# Altium schematic sheet Jednoruki_bandit.SchDoc
size A4
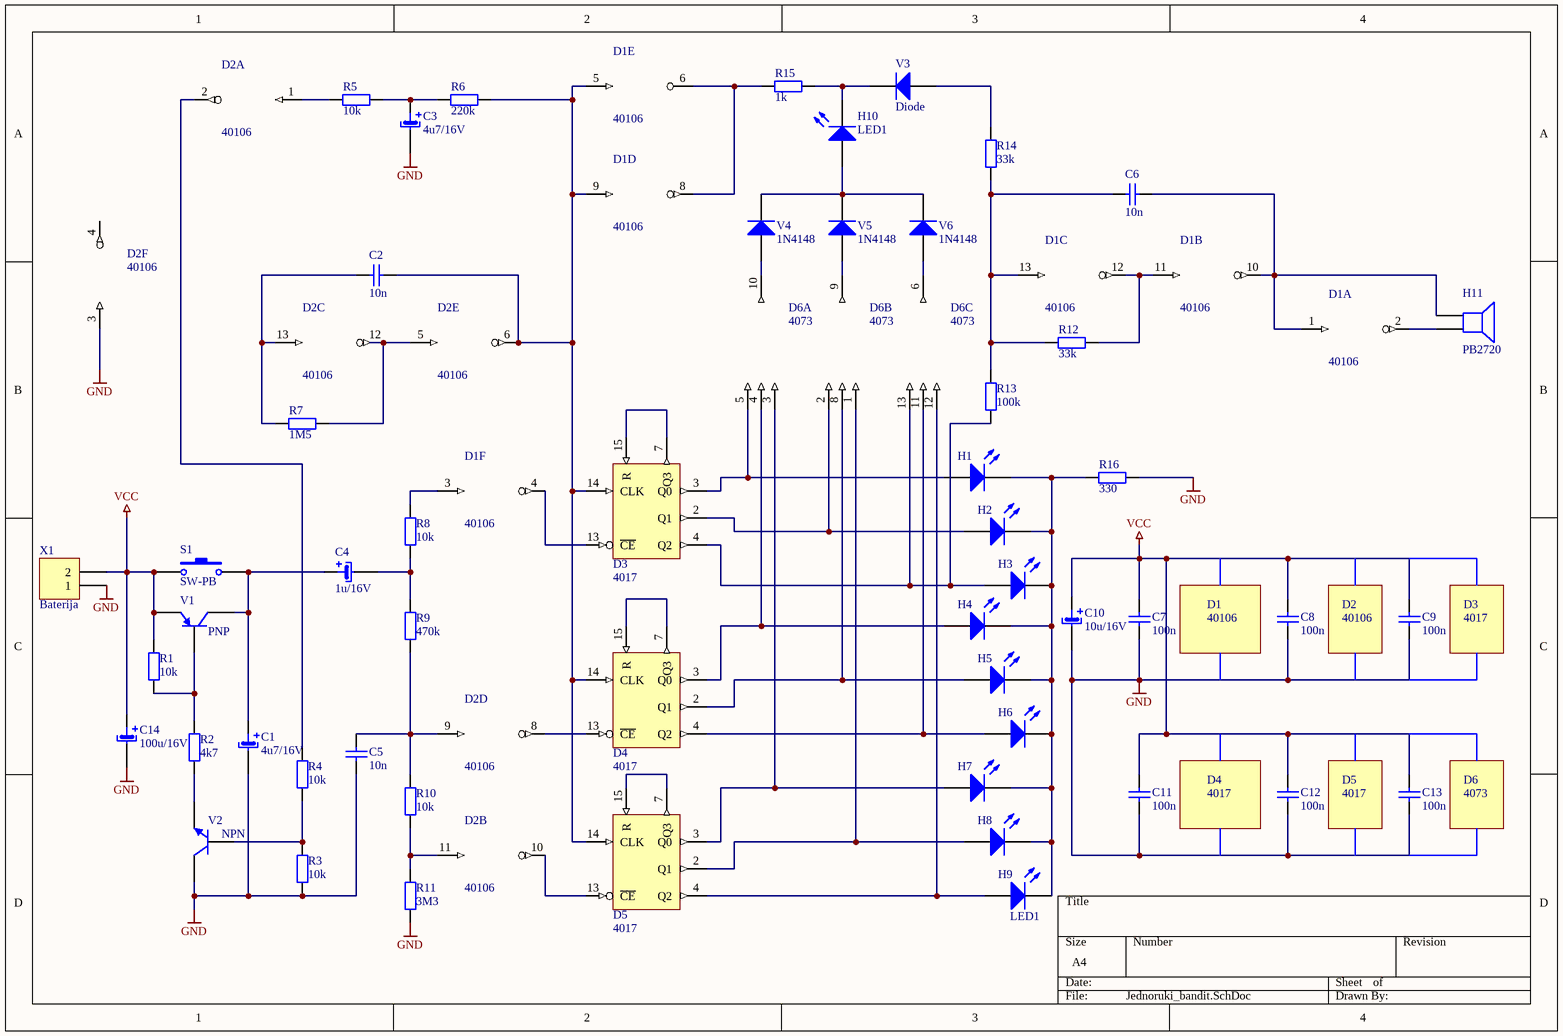
[diagram p0: Jednoruki_bandit.SchDoc]

## Parts
C1  4u7/16V  [CAPPR2-5x6.8]
C2  10n  [RAD-0.1]
C3  4u7/16V  [CAPPR2-5x6.8]
C4  1u/16V  [CAPPR2-5x6.8]
C5  10n  [RAD-0.1]
C6  10n  [RAD-0.1]
C7  100n  [RAD-0.1]
C8  100n  [RAD-0.1]
C9  100n  [RAD-0.1]
C10  10u/16V  [CAPPR2-5x6.8]
C11  100n  [RAD-0.1]
C12  100n  [RAD-0.1]
C13  100n  [RAD-0.1]
C14  100u/16V  [CAPPR2-5x6.8]
D1  40106  [DIP-14]  (parts A,B,C,D,E,F of 6)
D2  40106  [DIP-14]  (parts A,B,C,D,E,F of 6)
D3  4017  [DIP-16]
D4  4017  [DIP-16]
D5  4017  [DIP-16]
D6  4073  [DIP-14]  (parts A,B,C of 3)
H1  LED1  [LED-1]  (value not drawn)
H2  LED1  [LED-1]  (value not drawn)
H3  LED1  [LED-1]  (value not drawn)
H4  LED1  [LED-1]  (value not drawn)
H5  LED1  [LED-1]  (value not drawn)
H6  LED1  [LED-1]  (value not drawn)
H7  LED1  [LED-1]  (value not drawn)
H8  LED1  [LED-1]  (value not drawn)
H9  LED1  [LED-1]
H10  LED1  [LED-1]
H11  PB2720  [PIN2]
R1  10k  [AXIAL-0.4]
R2  4k7  [AXIAL-0.4]
R3  10k  [AXIAL-0.4]
R4  10k  [AXIAL-0.4]
R5  10k  [AXIAL-0.4]
R6  220k  [AXIAL-0.4]
R7  1M5  [AXIAL-0.4]
R8  10k  [AXIAL-0.4]
R9  470k  [AXIAL-0.4]
R10  10k  [AXIAL-0.4]
R11  3M3  [AXIAL-0.4]
R12  33k  [AXIAL-0.4]
R13  100k  [AXIAL-0.4]
R14  33k  [AXIAL-0.4]
R15  1k  [AXIAL-0.4]
R16  330  [AXIAL-0.4]
S1  SW-PB  [SPST-2]
V1  PNP  [TO-92A]
V2  NPN  [TO-92A]
V3  Diode  [DO-35]
V4  1N4148  [DIO7.1-3.9x1.9]
V5  1N4148  [DIO7.1-3.9x1.9]
V6  1N4148  [DIO7.1-3.9x1.9]
X1  Baterija  [HDR1X2]

## Nets
GND: C1.2 C3.2 C5.1 C7.1 C8.1 C9.1 C10.2 C11.1 C12.1 C13.1 C14.2 D1.7(GND) D2.3 D2.7(GND) D3.8(GND) D4.8(GND) D5.8(GND) D6.7(GND) R3.1 R11.1 R16.2 V2.1(C) X1.1
VCC: C7.2 C8.2 C9.2 C10.1 C11.2 C12.2 C13.2 C14.1 D1.14(VCC) D2.14(VCC) D3.16(VCC) D4.16(VCC) D5.16(VCC) D6.14(VCC) R1.2 S1.1 V1.3(E) X1.2
NetC1_1: C1.1 C4.1 S1.2 V1.1(C)
NetC2_1: C2.1 D2.13 R7.1
NetC2_2: C2.2 D1.5 D1.9 D2.6 D3.14(CLK) D4.14(CLK) D5.14(CLK) R6.2
NetC3_1: C3.1 R5.2 R6.1
NetC4_2: C4.2 R8.1 R9.2
NetC5_2: C5.2 D2.9 R9.1 R10.2
NetC6_1: C6.1 D1.13 R12.2 R13.2 R14.1
NetC6_2: C6.2 D1.1 D1.10 H11.1
NetD1_2: D1.2 H11.2
NetD1_3: D1.3 R8.2
NetD1_4: D1.4 D3.13(~{CE})
NetD1_6: D1.6 D1.8 R15.1
NetD1_11: D1.11 D1.12 R12.1
NetD2_1: D2.1 R5.1
NetD2_2: D2.2 R4.2
NetD2_5: D2.5 D2.12 R7.2
NetD2_8: D2.8 D4.13(~{CE})
NetD2_10: D2.10 D5.13(~{CE})
NetD2_11: D2.11 R10.1 R11.2
NetD3_2: D3.2(Q1) D6.2 H2.1(A)
NetD3_3: D3.3(Q0) D6.5 H1.1(A)
NetD3_4: D3.4(Q2) D6.13 H3.1(A) R13.1
NetD3_7: D3.7(Q3) D3.15(R)
NetD4_2: D4.2(Q1) D6.8 H5.1(A)
NetD4_3: D4.3(Q0) D6.4 H4.1(A)
NetD4_4: D4.4(Q2) D6.11 H6.1(A)
NetD4_7: D4.7(Q3) D4.15(R)
NetD5_2: D5.2(Q1) D6.1 H8.1(A)
NetD5_3: D5.3(Q0) D6.3 H7.1(A)
NetD5_4: D5.4(Q2) D6.12 H9.1(A)
NetD5_7: D5.7(Q3) D5.15(R)
NetD6_6: D6.6 V6.1(A)
NetD6_9: D6.9 V5.1(A)
NetD6_10: D6.10 V4.1(A)
NetH1_2: H1.2(K) H2.2(K) H3.2(K) H4.2(K) H5.2(K) H6.2(K) H7.2(K) H8.2(K) H9.2(K) R16.1
NetH10_1: H10.1(A) V4.2(K) V5.2(K) V6.2(K)
NetH10_2: H10.2(K) R15.2 V3.2(K)
NetR1_1: R1.1 R2.2 V1.2(B)
NetR2_1: R2.1 V2.3(E)
NetR3_2: R3.2 R4.1 V2.2(B)
NetR14_2: R14.2 V3.1(A)

Not connected (* = marked no-connect by the designer): D2 4

## Notes on the sheet
- D1
- 40106
- D2
- D3
- 4017
- D4
- D5
- D6
- 4073

## Library data of the parts
C1 C14 = Elektrolitski_kondenzator: Redni broj: 18; Oznake komponenata: C1; Opis komponente: Elektrolitski kondenzator 4u7 /16V ± 20%; Katalog dobavljaca: Farnell; Kataloski broj: 1236656; Kolicina: 2; Proizvodjac: MULTICOMP; Kuciste: CAPPR2-5x6.8
C2 = Cap: Capacitor; Opis komponente: Kondenzator 10n; Oznake komponenata: C2; Redni broj: 21; Katalog dobavljaca: Farnell; Kataloski broj: 1216432; Kolicina: 3; Proizvodjac: MULTICOMP; Kuciste: RAD-0.1
C3 = Elektrolitski_kondenzator: Redni broj: 18; Oznake komponenata: C3; Opis komponente: Elektrolitski kondenzator 4u7 /16V ± 20%; Katalog dobavljaca: Farnell; Kataloski broj: 1236656; Kolicina: 2; Proizvodjac: MULTICOMP; Kuciste: CAPPR2-5x6.8
C4 = Elektrolitski_kondenzator: Redni broj: 19; Oznake komponenata: C4; Opis komponente: Elektrolitski kondenzator 1u/16V ± 20%; Katalog dobavljaca: Farnell; Kataloski broj: 1236655; Kolicina: 1; Proizvodjac: MULTICOMP; Kuciste: CAPPR2-5x6.8
C5 = Cap: Capacitor; Opis komponente: Kondenzator 10n; Oznake komponenata: C5; Redni broj: 21; Katalog dobavljaca: Farnell; Kataloski broj: 1216432; Kolicina: 3; Proizvodjac: MULTICOMP; Kuciste: RAD-0.1
C6 = Cap: Capacitor; Opis komponente: Kondenzator 10n; Oznake komponenata: C6; Redni broj: 21; Katalog dobavljaca: Farnell; Kataloski broj: 1216432; Kolicina: 3; Proizvodjac: MULTICOMP; Kuciste: RAD-0.1
C7 = Cap: Capacitor; Opis komponente: Blokadni kondenzator keramicki 100n; Oznake komponenata: C7; Redni broj: 22; Katalog dobavljaca: Farnell; Kataloski broj: 1702665; Kolicina: 6; Proizvodjac: KEMET; Kuciste: RAD-0.1
C8 = Cap: Capacitor; Opis komponente: Blokadni kondenzator keramicki 100n; Oznake komponenata: C8; Redni broj: 22; Katalog dobavljaca: Farnell; Kataloski broj: 1702665; Kolicina: 6; Proizvodjac: KEMET; Kuciste: RAD-0.1
C9 = Cap: Capacitor; Opis komponente: Blokadni kondenzator keramicki 100n; Oznake komponenata: C9; Redni broj: 22; Katalog dobavljaca: Farnell; Kataloski broj: 1702665; Kolicina: 6; Proizvodjac: KEMET; Kuciste: RAD-0.1
C10 = Elektrolitski_kondenzator: Redni broj: 20; Oznake komponenata: C10; Opis komponente: Elektrolitski kondenzator 10u /16V ± 20%; Katalog dobavljaca: Farnell; Kataloski broj: 8766894; Kolicina: 1; Proizvodjac: MULTICOMP; Kuciste: CAPPR2-5x6.8
C11 = Cap: Capacitor; Opis komponente: Blokadni kondenzator keramicki 100n; Oznake komponenata: C11; Redni broj: 22; Katalog dobavljaca: Farnell; Kataloski broj: 1702665; Kolicina: 6; Proizvodjac: KEMET; Kuciste: RAD-0.1
C12 = Cap: Capacitor; Opis komponente: Blokadni kondenzator keramicki 100n; Oznake komponenata: C12; Redni broj: 22; Katalog dobavljaca: Farnell; Kataloski broj: 1702665; Kolicina: 6; Proizvodjac: KEMET; Kuciste: RAD-0.1
C13 = Cap: Capacitor; Opis komponente: Blokadni kondenzator keramicki 100n; Oznake komponenata: C13; Redni broj: 22; Katalog dobavljaca: Farnell; Kataloski broj: 1702665; Kolicina: 6; Proizvodjac: KEMET; Kuciste: RAD-0.1
D1 = 40106: Redni broj: 2; Oznake komponenata: D1; Opis komponente: Invertor; Katalog dobavljaca: Chipoteka; Kataloski broj: 0004010601; Kolicina: 1; Proizvodjac: -; Kuciste: DIP-14
D2 = 40106: Redni broj: 2; Oznake komponenata: D2; Opis komponente: Invertor; Katalog dobavljaca: Chipoteka; Kataloski broj: 0004010601; Kolicina: 1; Proizvodjac: -; Kuciste: DIP-14
D3 = 4017: Redni broj: 1; Oznake komponenata: D3; Opis komponente: Dekadno brojilo; Katalog dobavljaca: Chipoteka; Kataloski broj: 0000401702; Kolicina: 1; Proizvodjac: -; Kuciste: DIP-16
D4 = 4017: Redni broj: 1; Oznake komponenata: D4; Opis komponente: Dekadno brojilo; Katalog dobavljaca: Chipoteka; Kataloski broj: 0000401702; Kolicina: 1; Proizvodjac: -; Kuciste: DIP-16
D5 = 4017: Redni broj: 1; Oznake komponenata: D5; Opis komponente: Dekadno brojilo; Katalog dobavljaca: Chipoteka; Kataloski broj: 0000401702; Kolicina: 1; Proizvodjac: -; Kuciste: DIP-16
D6 = 4073: Redni broj: 3; Oznake komponenata: D6; Opis komponente: AND vrata; Katalog dobavljaca: Chipoteka; Kataloski broj: 0000407301; Kolicina: 1; Proizvodjac: -; Kuciste: DIP-14
H1 = LED1: Typical RED GaAs LED; Opis komponente: LED dioda; Oznake komponenata: H1; Redni broj: 8; Katalog dobavljaca: Chipoteka; Kataloski broj: 1980019001; Kolicina: 10; Kuciste: LED-1; Proizvodjac: -
H2 = LED1: Typical RED GaAs LED; Opis komponente: LED dioda; Oznake komponenata: H2; Redni broj: 8; Katalog dobavljaca: Chipoteka; Kataloski broj: 1980019001; Kolicina: 10; Kuciste: LED-1; Proizvodjac: -
H3 = LED1: Typical RED GaAs LED; Opis komponente: LED dioda; Oznake komponenata: H3; Redni broj: 8; Katalog dobavljaca: Chipoteka; Kataloski broj: 1980019001; Kolicina: 10; Kuciste: LED-1; Proizvodjac: -
H4 = LED1: Typical RED GaAs LED; Opis komponente: LED dioda; Oznake komponenata: H4; Redni broj: 8; Katalog dobavljaca: Chipoteka; Kataloski broj: 1980019001; Kolicina: 10; Kuciste: LED-1; Proizvodjac: -
H5 = LED1: Typical RED GaAs LED; Opis komponente: LED dioda; Oznake komponenata: H5; Redni broj: 8; Katalog dobavljaca: Chipoteka; Kataloski broj: 1980019001; Kolicina: 10; Kuciste: LED-1; Proizvodjac: -
H6 = LED1: Typical RED GaAs LED; Opis komponente: LED dioda; Oznake komponenata: H6; Redni broj: 8; Katalog dobavljaca: Chipoteka; Kataloski broj: 1980019001; Kolicina: 10; Kuciste: LED-1; Proizvodjac: -
H7 = LED1: Typical RED GaAs LED; Opis komponente: LED dioda; Oznake komponenata: H7; Redni broj: 8; Katalog dobavljaca: Chipoteka; Kataloski broj: 1980019001; Kolicina: 10; Kuciste: LED-1; Proizvodjac: -
H8 = LED1: Typical RED GaAs LED; Opis komponente: LED dioda; Oznake komponenata: H8; Redni broj: 8; Katalog dobavljaca: Chipoteka; Kataloski broj: 1980019001; Kolicina: 10; Kuciste: LED-1; Proizvodjac: -
H9 = LED1: Typical RED GaAs LED; Opis komponente: LED dioda; Oznake komponenata: H9; Redni broj: 8; Katalog dobavljaca: Chipoteka; Kataloski broj: 1980019001; Kolicina: 10; Kuciste: LED-1; Proizvodjac: -
H10 = LED1: Typical RED GaAs LED; Opis komponente: LED dioda; Oznake komponenata: H10; Redni broj: 8; Katalog dobavljaca: Chipoteka; Kataloski broj: 1980019001; Kolicina: 10; Kuciste: LED-1; Proizvodjac: -
H11 = Speaker: Loudspeaker; Opis komponente: Zvucnik; Oznake komponenata: H11; Redni broj: 25; Katalog dobavljaca: Chipoteka; Kataloski broj: 8070200031; Kolicina: 1; Kuciste: PIN2; Proizvodjac: -
R1 = Res2: Resistor; Opis komponente: Otpornik metalfilm  10k /0.6 W , ± 1%; Oznake komponenata: R1; Redni broj: 9; Katalog dobavljaca: Chipoteka; Kataloski broj: 2210074001; Kolicina: 6; Kuciste: AXIAL-0.4; Proizvodjac: -
R2 = Res2: Resistor; Opis komponente: Otpornik 4k7 / 0.25W,  ± 5%; Oznake komponenata: R2; Redni broj: 10; Katalog dobavljaca: Farnell; Kataloski broj: 1265077; Kolicina: 1; Proizvodjac: TYCO ELECTRONICS / NEOHM; Kuciste: AXIAL-0.4
R3 = Res2: Resistor; Opis komponente: Otpornik metalfilm  10k /0.6 W , ± 1%; Oznake komponenata: R3; Redni broj: 9; Katalog dobavljaca: Chipoteka; Kataloski broj: 2210074001; Kolicina: 6; Kuciste: AXIAL-0.4; Proizvodjac: -
R4 = Res2: Resistor; Opis komponente: Otpornik metalfilm  10k /0,6 W , ± 1%; Oznake komponenata: R4; Redni broj: 9; Katalog dobavljaca: Chipoteka; Kataloski broj: 2210074001; Kolicina: 6; Kuciste: AXIAL-0.4; Proizvodjac: -
R5 = Res2: Resistor; Opis komponente: Otpornik metalfilm  10k /0,6 W , ± 1%; Oznake komponenata: R5; Redni broj: 9; Katalog dobavljaca: Chipoteka; Kataloski broj: 2210074001; Kolicina: 6; Kuciste: AXIAL-0.4; Proizvodjac: -
R6 = Res2: Resistor; Opis komponente: Otpornik 220k / 0.25W,  ± 5%; Oznake komponenata: R6; Redni broj: 13; Katalog dobavljaca: Farnell; Kataloski broj: 1265087; Kolicina: 1; Proizvodjac: TYCO ELECTRONICS / NEOHM; Kuciste: AXIAL-0.4
R7 = Res2: Resistor; Opis komponente: Otpornik 1M5  / 0.25W, ± 5%; Oznake komponenata: R7; Redni broj: 12; Katalog dobavljaca: Farnell; Kataloski broj: 1265094; Kolicina: 1; Proizvodjac: TYCO ELECTRONICS / NEOHM; Kuciste: AXIAL-0.4
R8 = Res2: Resistor; Opis komponente: Otpornik metalfilm  10k /0.6 W , ± 1%; Oznake komponenata: R8; Redni broj: 9; Katalog dobavljaca: Chipoteka; Kataloski broj: 2210074001; Kolicina: 6; Kuciste: AXIAL-0.4; Proizvodjac: -
R9 = Res2: Resistor; Opis komponente: Otpornik 470k / 0.25W, ± 5%; Oznake komponenata: R9; Redni broj: 12; Katalog dobavljaca: Farnell; Kataloski broj: 1265091; Kolicina: 1; Proizvodjac: TYCO ELECTRONICS / NEOHM; Kuciste: AXIAL-0.4
R10 = Res2: Resistor; Opis komponente: Otpornik metalfilm  10k /0.6 W , ± 1%; Oznake komponenata: R10; Redni broj: 9; Katalog dobavljaca: Chipoteka; Kataloski broj: 2210074001; Kolicina: 6; Kuciste: AXIAL-0.4; Proizvodjac: -
R11 = Res2: Resistor; Opis komponente: Otpornik 3M3 / 0.25W, ± 5%; Oznake komponenata: R11; Redni broj: 11; Katalog dobavljaca: Farnell; Kataloski broj: 1265096; Kolicina: 1; Proizvodjac: TYCO ELECTRONICS / NEOHM; Kuciste: AXIAL-0.4
R12 = Res2: Resistor; Opis komponente: Otpornik 33k / 2W,  ± 5%; Oznake komponenata: R12; Redni broj: 15; Katalog dobavljaca: Farnell; Kataloski broj: 489773; Kolicina: 2; Proizvodjac: MULTICOMP; Kuciste: AXIAL-0.4
R13 = Res2: Resistor; Opis komponente: Otpornik 100k / 0.25W, ± 1%; Oznake komponenata: R13; Redni broj: 16; Katalog dobavljaca: Farnell; Kataloski broj: 9341129; Kolicina: 1; Proizvodjac: MULTICOMP; Kuciste: AXIAL-0.4
R14 = Res2: Resistor; Opis komponente: Otpornik 33k/2W, ± 5%; Oznake komponenata: R14; Redni broj: 15; Katalog dobavljaca: Farnell; Kataloski broj: 489773; Kolicina: 2; Proizvodjac: MULTICOMP; Kuciste: AXIAL-0.4
R15 = Res2: Resistor; Opis komponente: Otpornik 1k  /0.25W, ± 1%; Oznake komponenata: R15; Redni broj: 14; Katalog dobavljaca: Farnell; Kataloski broj: 9341102; Kolicina: 1; Proizvodjac: MULTICOMP; Kuciste: AXIAL-0.4
R16 = Res2: Resistor; Opis komponente: Otpornik 330R /0.25W,  ± 5%; Oznake komponenata: R16; Redni broj: 17; Katalog dobavljaca: Farnell; Kataloski broj: 3278153; Kolicina: 1; Proizvodjac: TYCO ELECTRONICS; Kuciste: AXIAL-0.4
S1 = SW-PB: Switch; Opis komponente: Tipkalo; Oznake komponenata: S1; Redni broj: 24; Katalog dobavljaca: Farnell; Kataloski broj: 1206168; Kolicina: 1; Proizvodjac: CARLING TECHNOLOGIES; Kuciste: SPST-2
V1 = PNP: PNP Bipolar Transistor; Opis komponente: PNP tranzistor BC557; Oznake komponenata: V1; Kuciste: TO-92; Redni broj: 4; Katalog dobavljaca: Farnell; Kataloski broj: 1467882; Kolicina: 1; Proizvodjac: FAIRCHILD SEMICONDUCTOR
V2 = NPN: NPN Bipolar Transistor; Opis komponente: NPN tranzistor BC547; Oznake komponenata: V2; Kuciste: TO-92; Redni broj: 5; Katalog dobavljaca: Farnell; Kataloski broj: 1467870; Kolicina: 1; Proizvodjac: FAIRCHILD SEMICONDUCTOR
V3 = Diode: Default Diode; Opis komponente: Dioda 1N4454; Oznake komponenata: V3; Redni broj: 6; Katalog dobavljaca: Farnell; Kataloski broj: 1700796; Kolicina: 1; Proizvodjac: FAIRCHILD SEMICONDUCTOR; Kuciste: DO-35
V4 = Diode 1N4148: High Conductance Fast Diode; Opis komponente: Dioda 1N4148; Oznake komponenata: V4; Kuciste: DO-35; Redni broj: 7; Katalog dobavljaca: Farnell; Kataloski broj: 1611492; Kolicina: 1; Proizvodjac: NTE ELECTRONICS
V5 = Diode 1N4148: High Conductance Fast Diode; Opis komponente: Dioda 1N4148; Oznake komponenata: V5; Kuciste: DO-35; Redni broj: 7; Katalog dobavljaca: Farnell; Kataloski broj: 1611492; Kolicina: 1; Proizvodjac: NTE ELECTRONICS
V6 = Diode 1N4148: High Conductance Fast Diode; Opis komponente: Dioda 1N4148; Oznake komponenata: V6; Kuciste: DO-35; Redni broj: 7; Katalog dobavljaca: Farnell; Kataloski broj: 1611492; Kolicina: 1; Proizvodjac: NTE ELECTRONICS
X1 = Header 2: Header, 2-Pin; Opis komponente: Konektor za bateriju; Oznake komponenata: X1; Redni broj: 23; Katalog dobavljaca: Farnell; Kataloski broj: 1040801; Kolicina: 1; Proizvodjac: KEYSTONE; Kuciste: HDR1X2